# EAGLE design motor-shield (EAGLE 7.0.0)
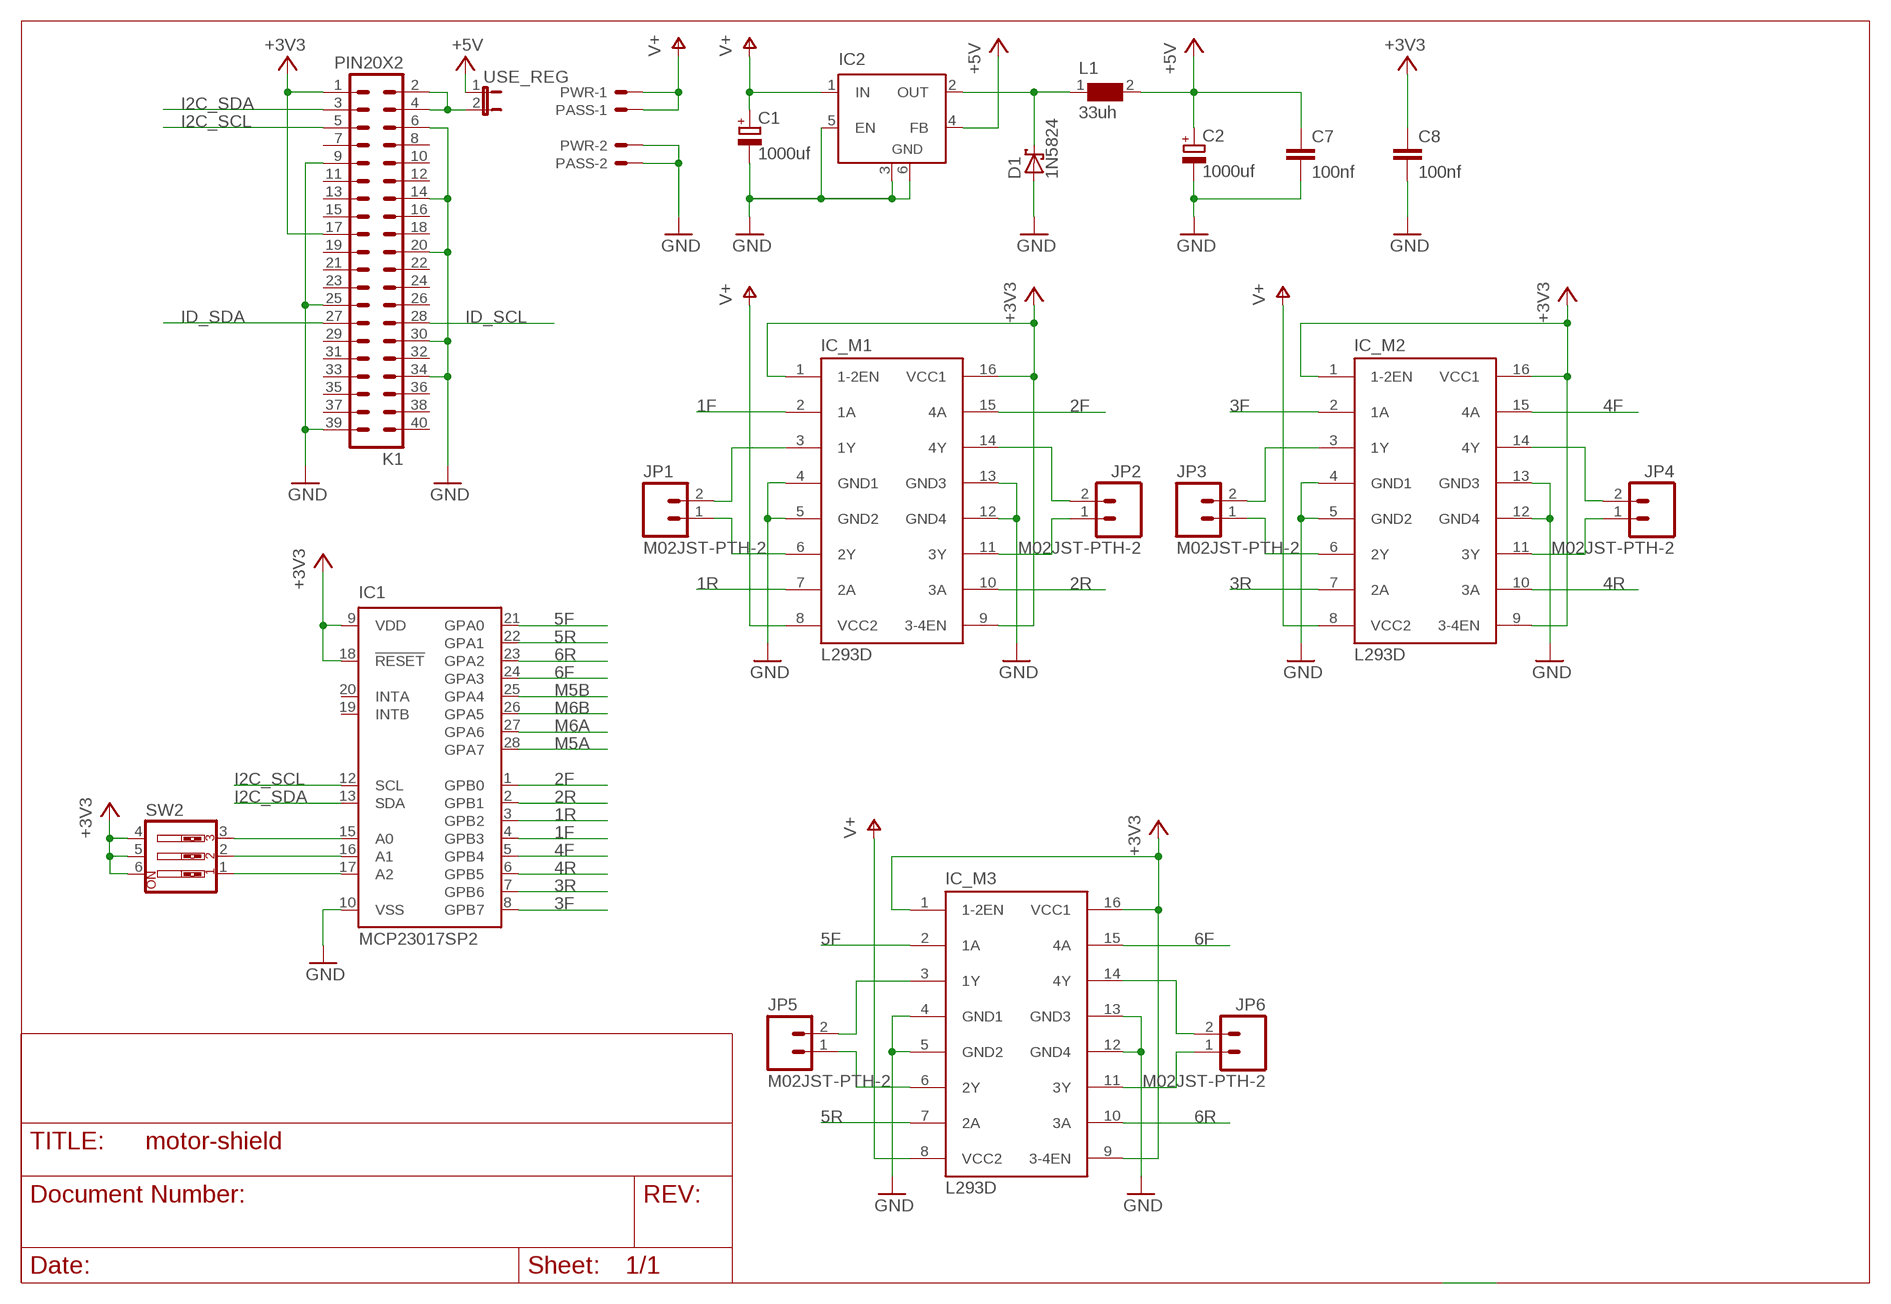
[diagram p0: schematic, sheet 1]

## Parts
C1  1000uf  CPOL-EUE2.5-6  [E2,5-6]
C2  1000uf  CPOL-EUE2.5-7  [E2,5-7]
C7  100nf  C-EU025-030X050  [C025-030X050]
C8  100nf  C-EU025-030X050  [C025-030X050]
D1  1N5824  1N5817-B  [DO41-7.6]
IC1  MCP23017SP2  [DIL28-3-ROUND]
IC2  LM2596S  [TO263-5]
IC_M1  L293D  [DIL16]
IC_M2  L293D  [DIL16]
IC_M3  L293D  [DIL16]
JP1  M02JST-PTH-2  [JST-2-PTH]
JP2  M02JST-PTH-2  [JST-2-PTH]
JP3  M02JST-PTH-2  [JST-2-PTH]
JP4  M02JST-PTH-2  [JST-2-PTH]
JP5  M02JST-PTH-2  [JST-2-PTH]
JP6  M02JST-PTH-2  [JST-2-PTH]
K1  PIN20X2  [PIN_20X2]
L1  33uh  WE-PD-744770133_1260/1245/1280/1210  [WE-PD_1260/1245/1280/1210]
PASS  22-05-7028-02  [7395-02]
PWR  22-05-7028-02  [7395-02]
SW2  SW_DIP-3  [EDG-03]
USE_REG  JP1E  [JP1]

## Nets
1F: IC1.4(GPB3) IC_M1.2(1A)
1R: IC1.3(GPB2) IC_M1.7(2A)
2F: IC1.1(GPB0) IC_M1.15(4A)
2R: IC1.2(GPB1) IC_M1.10(3A)
3F: IC1.8(GPB7) IC_M2.2(1A)
3R: IC1.7(GPB6) IC_M2.7(2A)
4F: IC1.5(GPB4) IC_M2.15(4A)
4R: IC1.6(GPB5) IC_M2.10(3A)
5F: IC1.21(GPA0) IC_M3.2(1A)
5R: IC1.22(GPA1) IC_M3.7(2A)
6F: IC1.24(GPA3) IC_M3.15(4A)
6R: IC1.23(GPA2) IC_M3.10(3A)
+3V3: C8.1 IC1.9(VDD) IC1.18(!RESET) IC_M1.1(1-2EN) IC_M1.9(3-4EN) IC_M1.16(VCC1) IC_M2.1(1-2EN) IC_M2.9(3-4EN) IC_M2.16(VCC1) IC_M3.1(1-2EN) IC_M3.9(3-4EN) IC_M3.16(VCC1) K1.1 K1.17 SW2.4 SW2.5 SW2.6
+5V: C2.+ C7.1 IC2.4(FB) L1.2 USE_REG.1
GND: C1.- C2.- C7.2 C8.2 D1.A IC1.10(VSS) IC2.3(GND) IC2.5(EN) IC2.6(GND) IC_M1.4(GND1) IC_M1.5(GND2) IC_M1.12(GND4) IC_M1.13(GND3) IC_M2.4(GND1) IC_M2.5(GND2) IC_M2.12(GND4) IC_M2.13(GND3) IC_M3.4(GND1) IC_M3.5(GND2) IC_M3.12(GND4) IC_M3.13(GND3) K1.6 K1.9 K1.14 K1.20 K1.25 K1.30 K1.34 K1.39 PASS.2 PWR.2
I2C_SCL: IC1.12(SCL) K1.5
I2C_SDA: IC1.13(SDA) K1.3
ID_SCL: K1.28
ID_SDA: K1.27
M5A: IC1.28(GPA7)
M5B: IC1.25(GPA4)
M6A: IC1.27(GPA6)
M6B: IC1.26(GPA5)
N$1: IC_M2.11(3Y) JP4.1
N$2: IC1.15(A0) SW2.3
N$3: IC1.16(A1) SW2.2
N$6: IC_M2.14(4Y) JP4.2
N$7: IC_M1.11(3Y) JP2.1
N$8: IC_M1.14(4Y) JP2.2
N$9: IC_M1.6(2Y) JP1.1
N$10: IC_M1.3(1Y) JP1.2
N$11: IC_M2.6(2Y) JP3.1
N$12: IC_M2.3(1Y) JP3.2
N$13: IC_M3.11(3Y) JP6.1
N$14: IC_M3.14(4Y) JP6.2
N$15: IC_M3.6(2Y) JP5.1
N$16: K1.2 K1.4 USE_REG.2
N$21: IC_M3.3(1Y) JP5.2
N$23: IC1.17(A2) SW2.1
V+: C1.+ IC2.1(IN) IC_M1.8(VCC2) IC_M2.8(VCC2) IC_M3.8(VCC2) PASS.1 PWR.1
VOUT: D1.C IC2.2(OUT) L1.1
Unconnected: IC1.19(INTB) IC1.20(INTA) K1.7 K1.8 K1.10 K1.11 K1.12 K1.13 K1.15 K1.16 K1.18 K1.19 K1.21 K1.22 K1.23 K1.24 K1.26 K1.29 K1.31 K1.32 K1.33 K1.35 K1.36 K1.37 K1.38 K1.40

## Library data of the parts
C1 C2 = rcl:CPOL-EU: POLARIZED CAPACITOR, European symbol
C7 C8 = rcl:C-EU: CAPACITOR, European symbol
D1 = diode:1N581*: 1.0A SCHOTTKY BARRIER RECTIFIER Source: http://www.diodes.com/datasheets/ds23001.pdf
IC1 = adafruit:MCP23017: http://ww1.microchip.com/downloads/en/DeviceDoc/21952a.pdf Source: http://ww1.microchip.com/downloads/en/DeviceDoc/21952a.pdf
IC2 = linear:LM2596S: STEP-DOWN VOLTAGE REGULATOR
IC_M1-IC_M3 = st-microelectronics:L293D: PUSH-PULL 4 CHANNEL DRIVER; MPN: L293D; OC_FARNELL: 9589619; OC_NEWARK: 56P8249
JP1-JP6 = SparkFun-Connectors:M02: Standard 2-pin 0.1" header. Use with - straight break away headers ( PRT-00116) - right angle break away headers (PRT-00553) - swiss pins (PRT-00743) - machine pins (PRT-00117) - female headers (PRT-00115) Molex polarized connector foot print use with: PRT-08233 with associated crimp pins and housings. 2.54_SCREWTERM for use with PRT-10571. 3.5mm Screw Terminal footprints for PRT-08084 5mm Screw Terminal footprints for use with PRT-08432; SKU: PRT-09914
K1 = FLYFISH:PIN20X2
L1 = WE-PD:WE-PD: SMD-Shielded Power Inductors WE-PD - Magnetically shielded version which results in a low leakage field - High storage capacity - Low self-losses - Highest possible current loading for SMD-Inducors -- Switching regulators with low operating voltages (computer, laptop, mobile phones, pagers) -- Integrated DC/DC-converter -- Is recommended for the application with switching regulators from National Semiconductor, Linear Technology, Texas Instruments and Fairchild Semiconductor, ect. -- Graphic cards -- Plastic base: Because of the one piece construction these are more suitable for high vibration or shock applications; MPN: 744770133; OC_FARNELL: 2082596; OC_NEWARK: 88T7068; PACKAGE: 1280; SUPPLIER: Wuerth Elektronik
PASS PWR = con-molex:22-?-02: CONNECTOR wire to board 2.54 mm (.1 inch) pitch header; OC_FARNELL: 9731601; OC_NEWARK: unknown
SW2 = special:SW_DIP-3: DIP SWITCH
USE_REG = jumper:JP1E: JUMPER

## Board
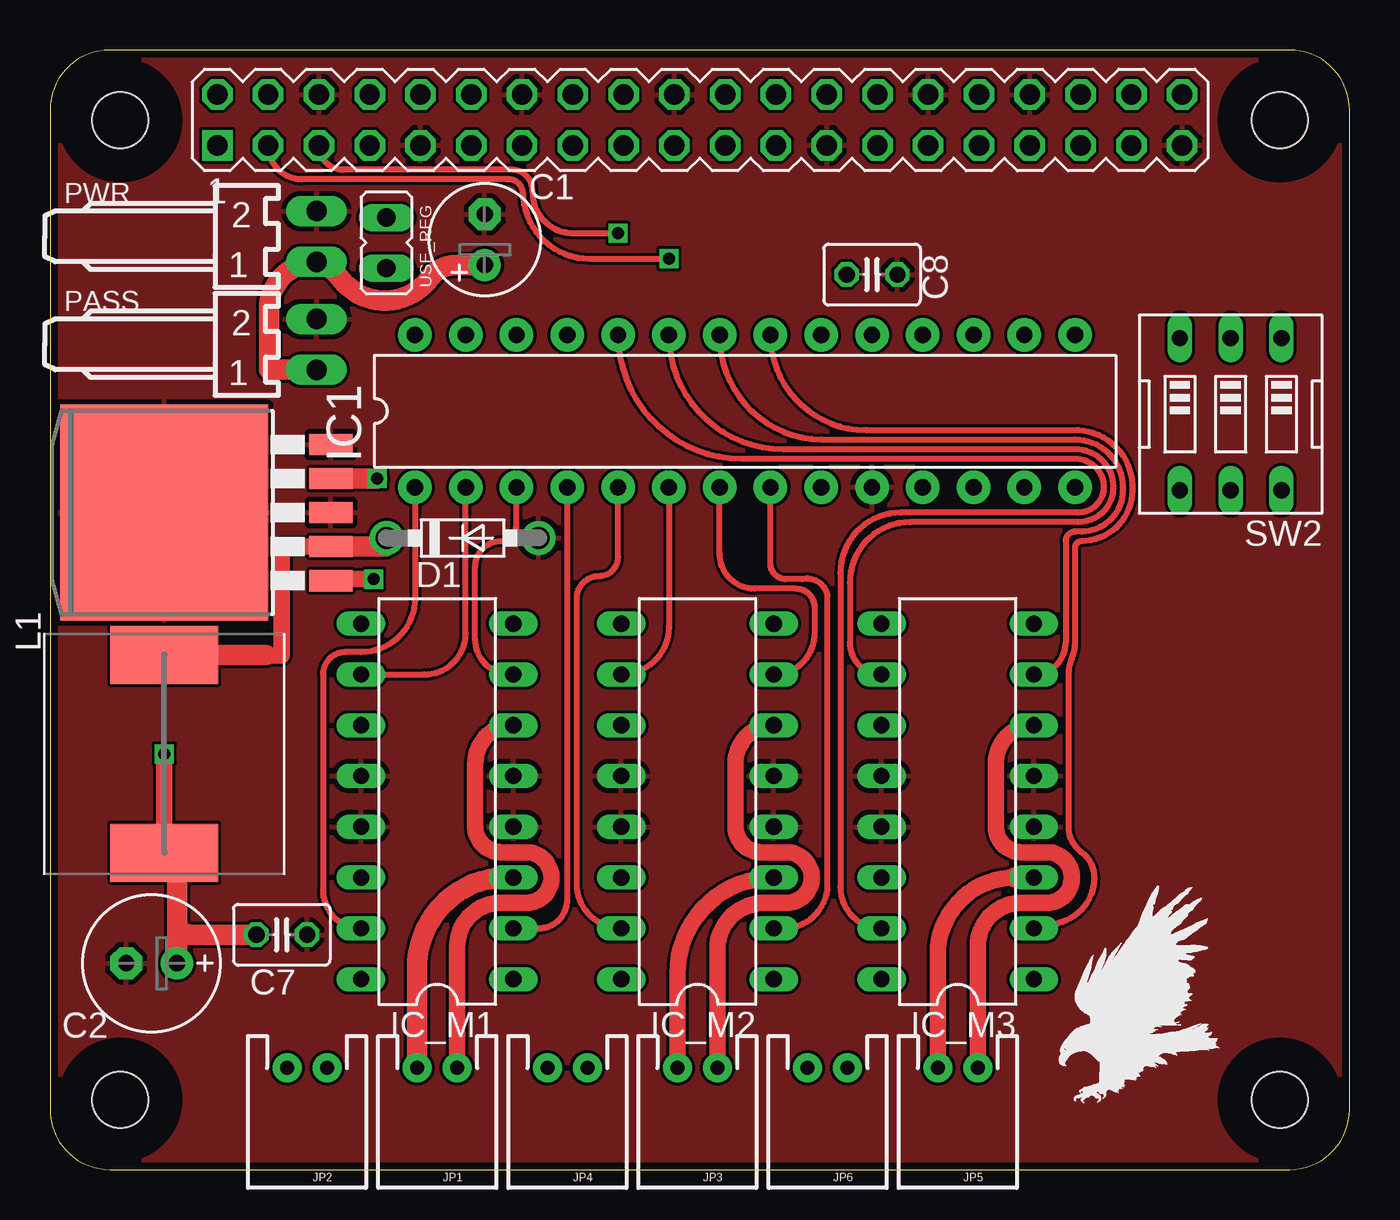
[diagram p1: board, top side]
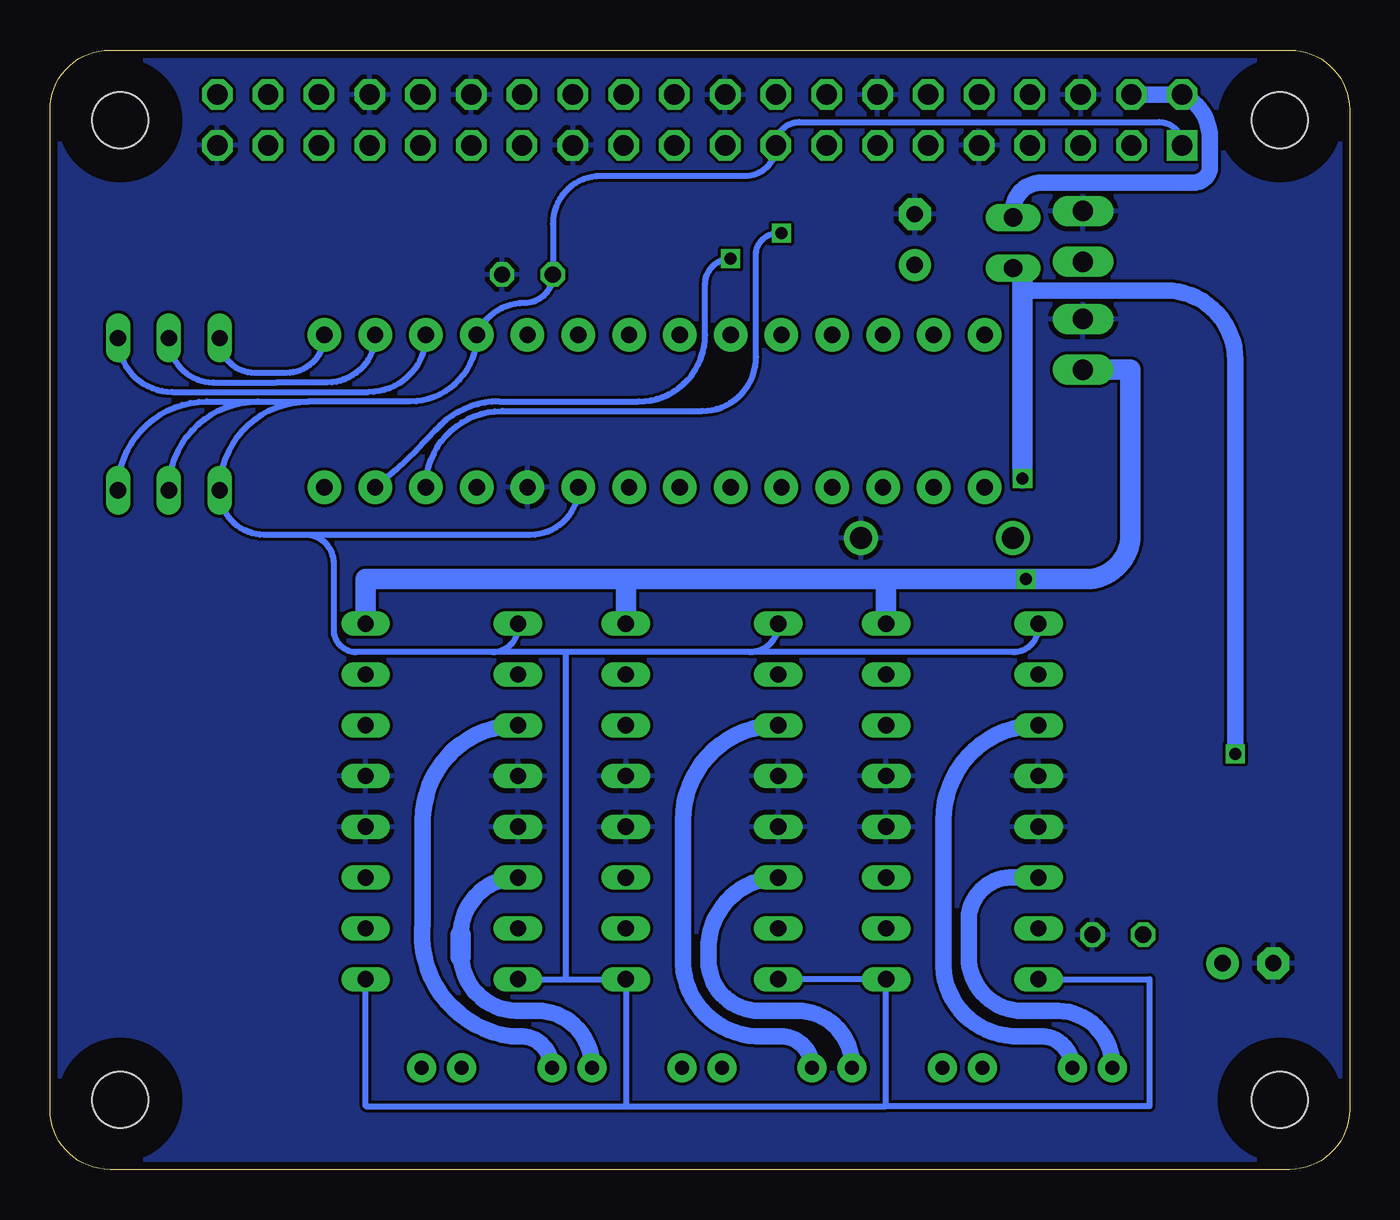
[diagram p2: board, bottom side, seen from below]

Size 65 x 56 mm. Coordinates in mm from the lower left corner, seen from the top.
Outline: 0,3 arc90 3,0 62,0 arc90 65,3 65,53 arc90 62,56 3,56 arc90 0,53 0,3
Copper layers (1*16): Top 0.0356mm / dielectric 1.5011mm / Bottom 0.0356mm
Design rules "LaenPCBOrder": minimum track width 6mil, minimum drill 13mil, track to track 6mil, track to pad 6mil, pad to pad 6mil, via to via 6mil, smd to smd 6mil, copper to edge 15mil, drill to drill 6mil, minimum pad ring 7mil, minimum via ring 7mil, stop-mask expansion 3mil, vias tented up to drill 0mil, thermal gap 10mil
Holes 2.8 mm at 3.5,3.5 3.5,52.5 61.5,52.5 61.5,3.5
tRestrict: area 1.9,51 to 5,54; area 60,51 to 63,54; area 60,1.9 to 63,5; area 1.9,1.9 to 5,5
bRestrict: area 1.9,1.9 to 5,5; area 1.9,51 to 5,54; area 60,1.9 to 63,5; area 60,51 to 63,54

### Footprints (pad centres in the part's own frame; a part is rotated, then mirrored left to right if it is on the bottom)
E2,5-6 = drill 0.813 pad 1.6: + -1.27,0 | drill 0.813 pad 1.6 octagon: - 1.27,0
E2,5-7 = drill 0.813 pad 1.6: + -1.27,0 | drill 0.813 pad 1.6 octagon: - 1.27,0
C025-030X050 = drill 0.813 octagon: 1 -1.27,0; 2 1.27,0
DO41-7.6 = drill 1.1 pad 1.7: A 3.81,0; C -3.81,0
DIL28-3-ROUND = drill 0.813 pad 1.676: 1 -16.51,-3.81; 2 -13.97,-3.81; 3 -11.43,-3.81; 4 -8.89,-3.81; 5 -6.35,-3.81; 6 -3.81,-3.81; 7 -1.27,-3.81; 8 1.27,-3.81; 9 3.81,-3.81; 10 6.35,-3.81; 11 8.89,-3.81; 12 11.43,-3.81; 13 13.97,-3.81; 14 16.51,-3.81; 15 16.51,3.81; 16 13.97,3.81; 17 11.43,3.81; 18 8.89,3.81; 19 6.35,3.81; 20 3.81,3.81; 21 1.27,3.81; 22 -1.27,3.81; 23 -3.81,3.81; 24 -6.35,3.81; 25 -8.89,3.81; 26 -11.43,3.81; 27 -13.97,3.81; 28 -16.51,3.81
TO263-5 = smd 1.067 x 2.159: 1 -3.404,-5.791; 2 -1.702,-5.791; 3 0,-5.791; 4 1.702,-5.791; 5 3.404,-5.791 | smd 10.8 x 10.41: 6 0,2.54
DIL16 = drill 0.813 long: 1 -8.89,-3.81; 2 -6.35,-3.81; 3 -3.81,-3.81; 4 -1.27,-3.81; 5 1.27,-3.81; 6 3.81,-3.81; 7 6.35,-3.81; 8 8.89,-3.81; 9 8.89,3.81; 10 6.35,3.81; 11 3.81,3.81; 12 1.27,3.81; 13 -1.27,3.81; 14 -3.81,3.81; 15 -6.35,3.81; 16 -8.89,3.81
JST-2-PTH = drill 0.7 pad 1.448: 1 -1,0; 2 1,0
PIN_20X2 = drill 1.016 square: 1 -24.13,-1.27 | drill 1.016 octagon: 2 -24.13,1.27; 3 -21.59,-1.27; 4 -21.59,1.27; 5 -19.05,-1.27; 6 -19.05,1.27; 7 -16.51,-1.27; 8 -16.51,1.27; 9 -13.97,-1.27; 10 -13.97,1.27; 11 -11.43,-1.27; 12 -11.43,1.27; 13 -8.89,-1.27; 14 -8.89,1.27; 15 -6.35,-1.27; 16 -6.35,1.27; 17 -3.81,-1.27; 18 -3.81,1.27; 19 -1.27,-1.27; 20 -1.27,1.27; 21 1.27,-1.27; 22 1.27,1.27; 23 3.81,-1.27; 24 3.81,1.27; 25 6.35,-1.27; 26 6.35,1.27; 27 8.89,-1.27; 28 8.89,1.27; 29 11.43,-1.27; 30 11.43,1.27; 31 13.97,-1.27; 32 13.97,1.27; 33 16.51,-1.27; 34 16.51,1.27; 35 19.05,-1.27; 36 19.05,1.27; 37 21.59,-1.27; 38 21.59,1.27; 39 24.13,-1.27; 40 24.13,1.27
WE-PD_1260/1245/1280/1210 = smd 2.9 x 5.4: 1 -4.95,0; 2 4.95,0
7395-02 = drill 1.016 long: 1 1.27,0; 2 -1.27,0
EDG-03 = drill 0.813 long: 1 -2.54,-3.81; 2 0,-3.81; 3 2.54,-3.81; 4 2.54,3.81; 5 0,3.81; 6 -2.54,3.81
JP1 = drill 0.914 long: 1 0,-1.27; 2 0,1.27

### Placement (x,y rotation side)
C1  21.75,46.51 90 top
C2  5.08,10.32 180 top
C7  11.59,11.75 0 top
C8  41.12,44.77 0 top
D1  20.64,31.59 0 top
IC1  34.77,37.94 0 top
IC2  8.26,32.86 90 top
IC_M1  19.37,18.41 90 top
IC_M2  32.38,18.41 90 top
IC_M3  45.4,18.41 90 top
JP1  19.37,5.08 180 top
JP2  12.86,5.08 180 top
JP3  32.38,5.08 180 top
JP4  25.88,5.08 180 top
JP5  45.4,5.08 180 top
JP6  38.89,5.08 180 top
K1  32.5,52.5 0 top
L1  5.71,20.8 270 top
PASS  13.34,41.27 270 top
PWR  13.34,46.67 270 top
SW2  59.05,37.78 180 top
U$1  [EAGLE-PLC-8MM]  50.48,3.33 0 top
USE_REG  16.83,46.35 0 top

### Tracks (layer width: path | path; a pad name or v marks a point on that pad's centre or on a via)
1F
  Top 0.305: IC1.4 25.88,13.49 arc-90 24.45,12.06 IC_M1.2
1R
  Top 0.305: IC_M1.7 23.02,24.77 arc-90 21.27,26.51 21.27,30.16 arc-90 22.54,31.43 arc90 23.34,32.23 IC1.3
2F
  Top 0.305: IC1.1 18.26,28.57 arc-90 15.56,25.88 14.76,25.88 arc90 13.65,24.77 13.65,13.97 arc90 IC_M1.15
2R
  Top 0.305: IC_M1.10 18.73,24.77 arc90 20.8,26.83 IC1.2
3F
  Top 0.305: IC_M2.2 arc90 38.89,13.97 38.89,28.73 arc90 37.62,29.53 36.83,29.53 arc-90 36.04,30.32 IC1.8
3R
  Top 0.305: IC_M2.7 arc90 38.26,26.83 38.26,28.1 arc90 37.31,29.05 35.24,29.05 arc-90 33.5,30.8 IC1.7
4F
  Top 0.305: IC_M2.15 arc-90 26.35,14.29 26.35,28.57 arc-90 27.46,29.69 arc90 28.42,30.64 IC1.5
4R
  Top 0.305: IC1.6 30.96,27.15 arc-90 IC_M2.10
5F
  Top 0.305: IC1.21 arc90 40.8,36.99 51.44,36.99 arc-90 54.13,33.97 arc-90 51.59,31.43 arc90 51.28,31.11 51.28,26.51 arc-26 51.12,25.56 arc23 50.96,24.77 50.96,16.99 arc47 51.59,15.88 arc-53 52.23,14.61 arc-71 50.64,12.38 arc-13 IC_M3.2
5R
  Top 0.305: IC1.22 arc90 38.58,36.51 51.28,36.51 arc-90 53.66,34.13 53.66,33.97 arc-90 51.59,31.91 51.28,31.91 arc90 50.8,31.43 50.8,26.35 arc-90 IC_M3.7
6F
  Top 0.305: IC1.24 arc90 34.61,35.56 51.28,35.56 arc-90 52.7,34.13 arc-90 51.44,32.86 42.55,32.86 arc90 39.53,29.84 39.53,14.13 arc90 IC_M3.15
6R
  Top 0.305: IC1.23 arc90 36.67,36.04 51.28,36.04 arc-90 53.18,34.13 arc-90 51.44,32.38 43.02,32.38 arc90 40.01,29.37 40.01,26.35 arc90 IC_M3.10
+3V3
  Bottom 0.305: K1.1 arc-90 9.53,52.39 27.53,52.39 arc-90 K1.17 arc90 30.23,49.69 37.47,49.69 arc-90 39.85,47.31 C8.1 arc90 41.27,43.34 arc-67 IC1.18 arc90 46.99,38.42 52.07,38.42 | SW2.6 arc90 57.15,38.42 54.61,38.42 | SW2.5 arc90 54.61,38.42 | 54.61,38.42 52.07,38.42 | 52.07,38.42 arc-90 SW2.4 arc-90 54.29,31.75 52.23,31.75 | 30,25.88 16.83,25.88 arc-90 15.56,27.15 IC_M1.9 | 30,25.88 39.21,25.88 | IC_M1.16 10,9.53 10,3.17 23.18,3.17 | 23.18,3.17 IC_M1.1 IC_M2.16 | 36.2,3.17 IC_M2.1 39.21,9.53 | 36.2,3.17 23.18,3.17 | IC_M3.16 39.21,9.53 | 36.2,3.17 49.21,3.17 IC_M3.1 | 39.21,25.88 39.21,9.53 | IC1.9 arc90 40.96,31.75 52.23,31.75 | IC_M2.9 arc90 30,25.88 | 39.21,25.88 42.86,25.88 | 42.86,25.88 49.69,25.88 arc90 50.8,26.99 50.8,30.32 arc-90 52.23,31.75 | IC_M3.9 41.59,27.15 arc90 42.86,25.88
+5V  (via drill 0.6)
  Top 0.813: v5.71,20.8 L1.2
  Top 1.016: C2.+ 6.35,12.38 | 6.35,12.38 6.35,15.21 arc90 L1.2 | C7.1 6.99,11.75 arc-90 6.35,12.38 | IC2.4 v16.35,34.56
  Bottom 0.813: v5.71,20.8 5.71,40.48 arc-90 9.21,43.97 15.88,43.97 arc90 16.35,44.45
  Bottom 1.016: v16.35,34.56 16.35,44.45 16.35,45.09 USE_REG.1
GND
  pour Bottom: 0,3 arc90 3,0 62,0 arc90 65,3 65,53 arc90 62,56 3,56 arc90 0,53
  pour Top: 0,3 arc90 3,0 62,0 arc90 65,3 65,53 arc90 62,56 3,56 arc90 0,53 0.05,36.82
I2C_SCL  (via drill 0.6)
  Top 0.305: K1.5 arc90 14.67,50.01 23.18,50.01 arc-90 24.13,48.9 arc90 26.19,46.83 v28.42,46.83
  Bottom 0.305: IC1.12 arc90 42.39,37.94 32.38,37.94 arc-90 29.69,40.64 29.69,45.88 arc90 v28.42,46.83
I2C_SDA  (via drill 0.6)
  Top 0.305: K1.3 arc90 12.61,49.53 22.86,49.53 arc-90 23.65,48.9 arc90 26.99,45.56 v30.96,45.56
  Bottom 0.305: v30.96,45.56 arc-90 32.23,44.29 32.23,41.75 arc90 35.56,38.42 42.55,38.42 arc-48 45.72,36.99 arc10 IC1.13
N$1
  Bottom 0.813: JP4.1 arc-90 28.46,6.67 29.69,6.67 arc90 33.34,10.64 33.34,17.46 arc90 IC_M2.11
N$2
  Bottom 0.305: IC1.15 arc90 53.18,39.85 54.77,39.85 arc90 SW2.3
N$3
  Bottom 0.305: IC1.16 arc90 51.12,39.37 53.34,39.37 53.66,39.37 56.83,39.37 arc90 SW2.2
N$6
  Bottom 0.813: 24.88,5.19 arc-90 27.62,7.94 29.53,7.94 arc90 32.07,10.48 32.07,10.95 arc90 IC_M2.14
  Bottom 1.016: JP4.2 24.88,5.19
N$7
  Bottom 0.813: JP2.1 arc-90 15.45,6.67 16.51,6.67 arc90 20.32,10.16 20.32,17.46 arc90 IC_M1.11
N$8
  Bottom 0.813: JP2.2 arc-90 14.56,7.94 16.35,7.94 arc90 19.05,10.64 19.05,12.38 arc90 16.99,14.61 IC_M1.14
N$9
  Top 0.813: JP1.1 20.37,11.16 arc-90 22.54,13.34 23.81,13.34 arc90 25.08,14.61 arc90 23.81,15.88 22.54,15.88 arc-90 21.27,17.14 21.27,20.32 arc-90 IC_M1.6
N$10
  Top 1.016: JP1.2 18.37,10.43 arc-90 IC_M1.3
N$11
  Top 0.813: JP3.1 33.38,11 arc-90 35.72,13.34 36.83,13.34 arc90 38.1,14.61 arc90 36.83,15.88 35.56,15.88 arc-90 34.29,17.14 34.29,20.32 arc-90 IC_M2.6
N$12
  Top 0.813: JP3.2 31.39,9.79 arc-90 IC_M2.3
N$13
  Bottom 0.813: JP6.1 arc-90 41.48,6.67 41.91,6.67 arc90 46.35,12.38 46.35,17.46 arc90 IC_M3.11
N$14
  Bottom 0.813: 37.89,5.19 arc-90 40.64,7.94 41.43,7.94 arc90 44.45,10.64 | 44.45,11.75 arc90 IC_M3.14
  Bottom 1.016: JP6.2 37.89,5.19 | 44.45,10.64 44.45,11.75
N$15
  Top 0.813: JP5.1 46.4,11.16 arc-90 48.58,13.34 49.85,13.34 arc90 51.12,14.61 arc90 49.85,15.88 48.58,15.88 arc-90 47.31,17.14 47.31,20.32 arc-90 IC_M3.6
N$16
  Bottom 0.813: K1.4 K1.2 arc65 6.99,51.59 6.99,50.16 arc90 7.78,49.37 15.4,49.37 arc-90 16.83,47.94 USE_REG.2
N$21
  Top 0.813: JP5.2 44.4,10.75 arc-90 48.26,14.61
  Top 1.016: IC_M3.3 48.26,14.61
N$23
  Bottom 0.305: IC1.17 arc90 49.05,38.89 58.9,38.89 arc90 SW2.1
V+  (via drill 0.6)
  Top 0.813: v16.19,29.53 14.05,29.53 IC2.1
  Top 1.016: PASS.1 10.95,40.01 10.95,43.02 arc-90 PWR.1 arc-39 14.61,44.45 arc14 15.4,43.81 arc75 18.73,44.29 arc24 18.89,44.45 arc-57 20.32,45.24 C1.+
  Bottom 1.016: IC_M1.8 23.18,29.53 | 23.18,29.53 36.2,29.53 | 36.2,29.53 IC_M2.8 | IC_M3.8 49.21,29.53 36.2,29.53 | 23.18,29.53 v16.19,29.53 13.18,29.53 arc-90 10.95,31.75 10.95,40.01 PASS.1
VOUT
  Top 0.813: IC2.2 11.59,31.16 11.59,25.72 10.79,25.72 10.79,25.75
  Top 1.016: L1.1 10.79,25.75 | D1.C arc90 16.78,31.16 IC2.2